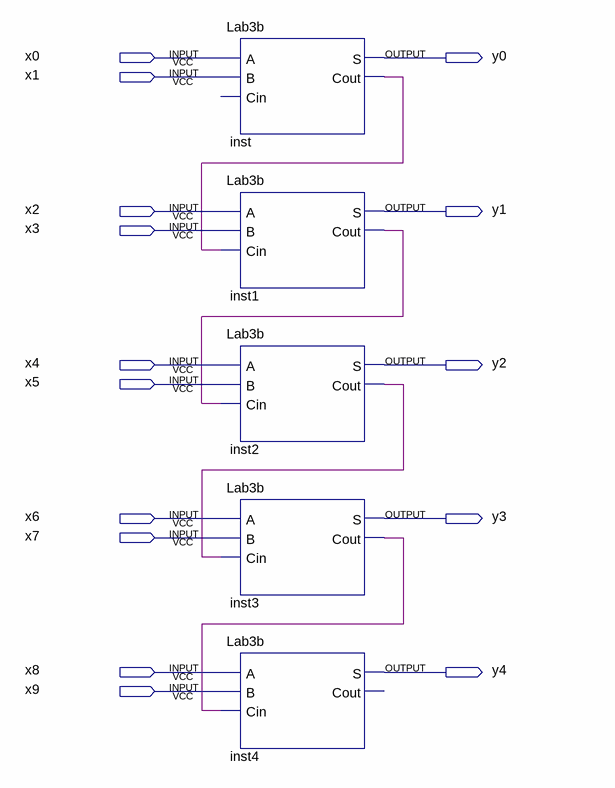
[diagram p0: schematic sheet]
// Quartus schematic Lab3b_bdf.bdf as structural Verilog: 5 symbols, 15 pins
module Lab3b_bdf (
  input  x0,
  input  x1,
  input  x2,
  input  x3,
  input  x4,
  input  x5,
  input  x6,
  input  x7,
  input  x8,
  input  x9,
  output y0,
  output y1,
  output y2,
  output y3,
  output y4
);

  wire inst1_cout, inst2_cout, inst3_cout, inst_cout;

  Lab3b inst (.A(x0), .B(x1), .S(y0), .Cout(inst_cout));  // open: Cin
  Lab3b inst1 (.A(x2), .B(x3), .Cin(inst_cout), .S(y1), .Cout(inst1_cout));
  Lab3b inst2 (.A(x4), .B(x5), .Cin(inst1_cout), .S(y2), .Cout(inst2_cout));
  Lab3b inst3 (.A(x6), .B(x7), .Cin(inst2_cout), .S(y3), .Cout(inst3_cout));
  Lab3b inst4 (.A(x8), .B(x9), .Cin(inst3_cout), .S(y4));  // open: Cout
endmodule
